# EasyEDA schematic SCH_arduino timer mertvyak_2023-02-15.json
TITLE: timer mertvyak; REV: 1.0; Date: 2023-02-14; Sheet: 1/1; Company: Your Company
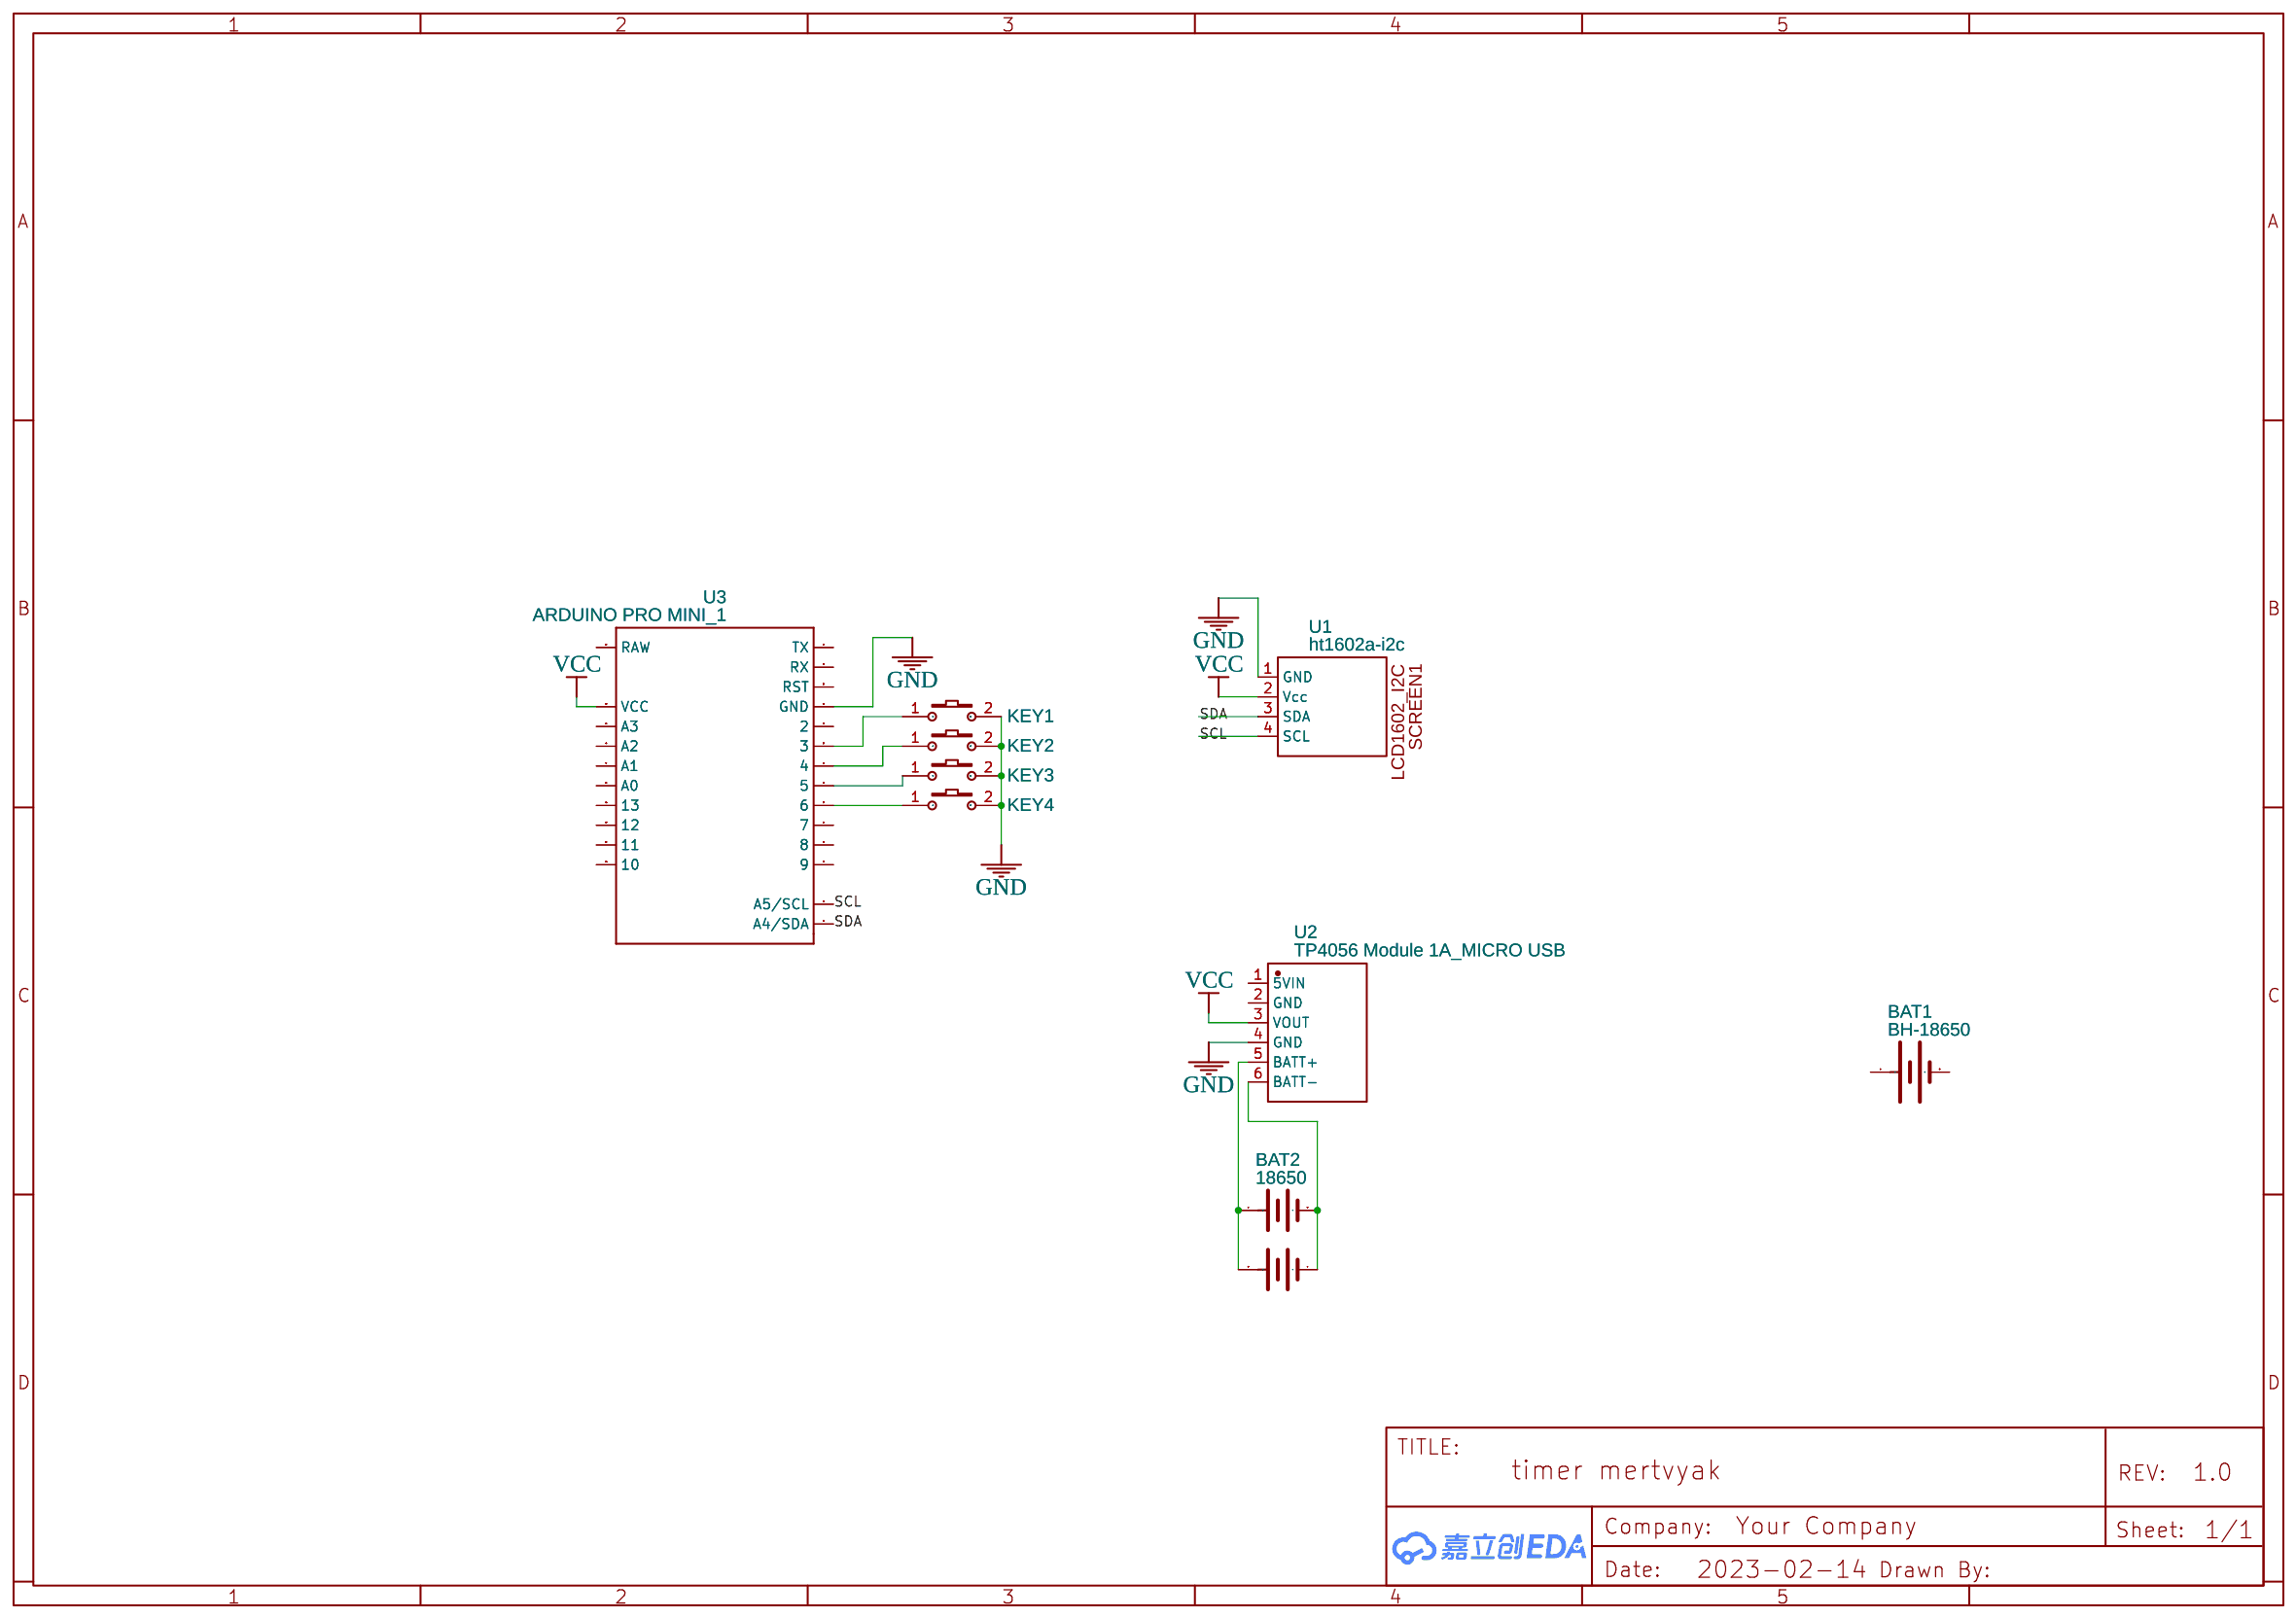
[diagram p0: schematic sheet]

## Parts
BAT1  BH-18650  [BAT-TH_BH-18650]
BAT2  18650  [BAT-TH_18650-2]
KEY1  K2-3.6×6.1_SMD  [KEY-SMD_2P-L6.2-W3.6-LS8.0]
KEY2  K2-3.6×6.1_SMD  [KEY-SMD_2P-L6.2-W3.6-LS8.0]
KEY3  K2-3.6×6.1_SMD  [KEY-SMD_2P-L6.2-W3.6-LS8.0]
KEY4  K2-3.6×6.1_SMD  [KEY-SMD_2P-L6.2-W3.6-LS8.0]
U1  ht1602a-i2c  [HT1602A-I2C]
U2  TP4056 Module 1A_MICRO USB  [TP4056 CHARGER MODULE]
U3  ARDUINO PRO MINI_1  [ARDUINOPROMINI_ARDUINO_PRO_MINI_1]

## Library data of the parts
BAT1 = BH-18650: Supplier: LCSC; Supplier Part: C9900017971; Manufacturer: null; Contributor: lcsc; JLCPCB Part Class: Extended Part
BAT2 = 18650并联电池盒: Supplier: LCSC; Supplier Part: C9900010344; Manufacturer: null; link: https://atta.szlcsc.comnull; JLCPCB Part Class: Extended Part; Contributor: LCSC
KEY1-KEY4 = K2-3.6×6.1_SMD: Supplier Part: C118141; Supplier: LCSC; Manufacturer Part: K2-1107ST-A4SW-06; Contributor: LCEDA_Lib; 制造商: 韩国韩荣
U1 = ht1602a-i2c: Contributor: Virsol
U2 = TP4056 Module 1A_MICRO USB: Manufacturer: China; Manufacturer Part: TP4056 MICROUSB 1A; Supplier: Electronicscomp; Supplier Part: EC-1275; link: https://www.electronicscomp.com/tp4056-1a-li-ion-lithium-battery-charging-module-with-current-protection-micro-usb?search=tp4056; Contributor: suraj4
U3 = ARDUINO PRO MINI_1: Arduino Pro Mini footprint; Contributor: virgonia

## Nets
GND: KEY1.2 KEY2.2 KEY3.2 KEY4.2 U1.1(GND) U2.4(GND) U3.GND
VCC: U1.2(Vcc) U2.3(VOUT) U3.VCC
SCL: U1.4(SCL) U3.A5(A5/SCL)
SDA: U1.3(SDA) U3.A4(A4/SDA)
Net-(BAT2-1): BAT2.1(+) BAT2.2(+) U2.5(BATT+)
Net-(BAT2-3): BAT2.3(-) BAT2.4(-) U2.6(BATT-)
Net-(KEY1-1): KEY1.1 U3.D3(3)
Net-(KEY2-1): KEY2.1 U3.D4(4)
Net-(KEY3-1): KEY3.1 U3.D5(5)
Net-(KEY4-1): KEY4.1 U3.D6(6)

Not connected (* = marked no-connect by the designer): BAT1 1(-) 2(+); U2 1(5VIN) 2(GND); U3 A0 A1 A2 A3 D2(2) D7(7) D8(8) D9(9) D10(10) D11(11) D12(12) D13(13) RAW RST RX TX
